# EAGLE design LoRaBB (EAGLE 9.6.2)
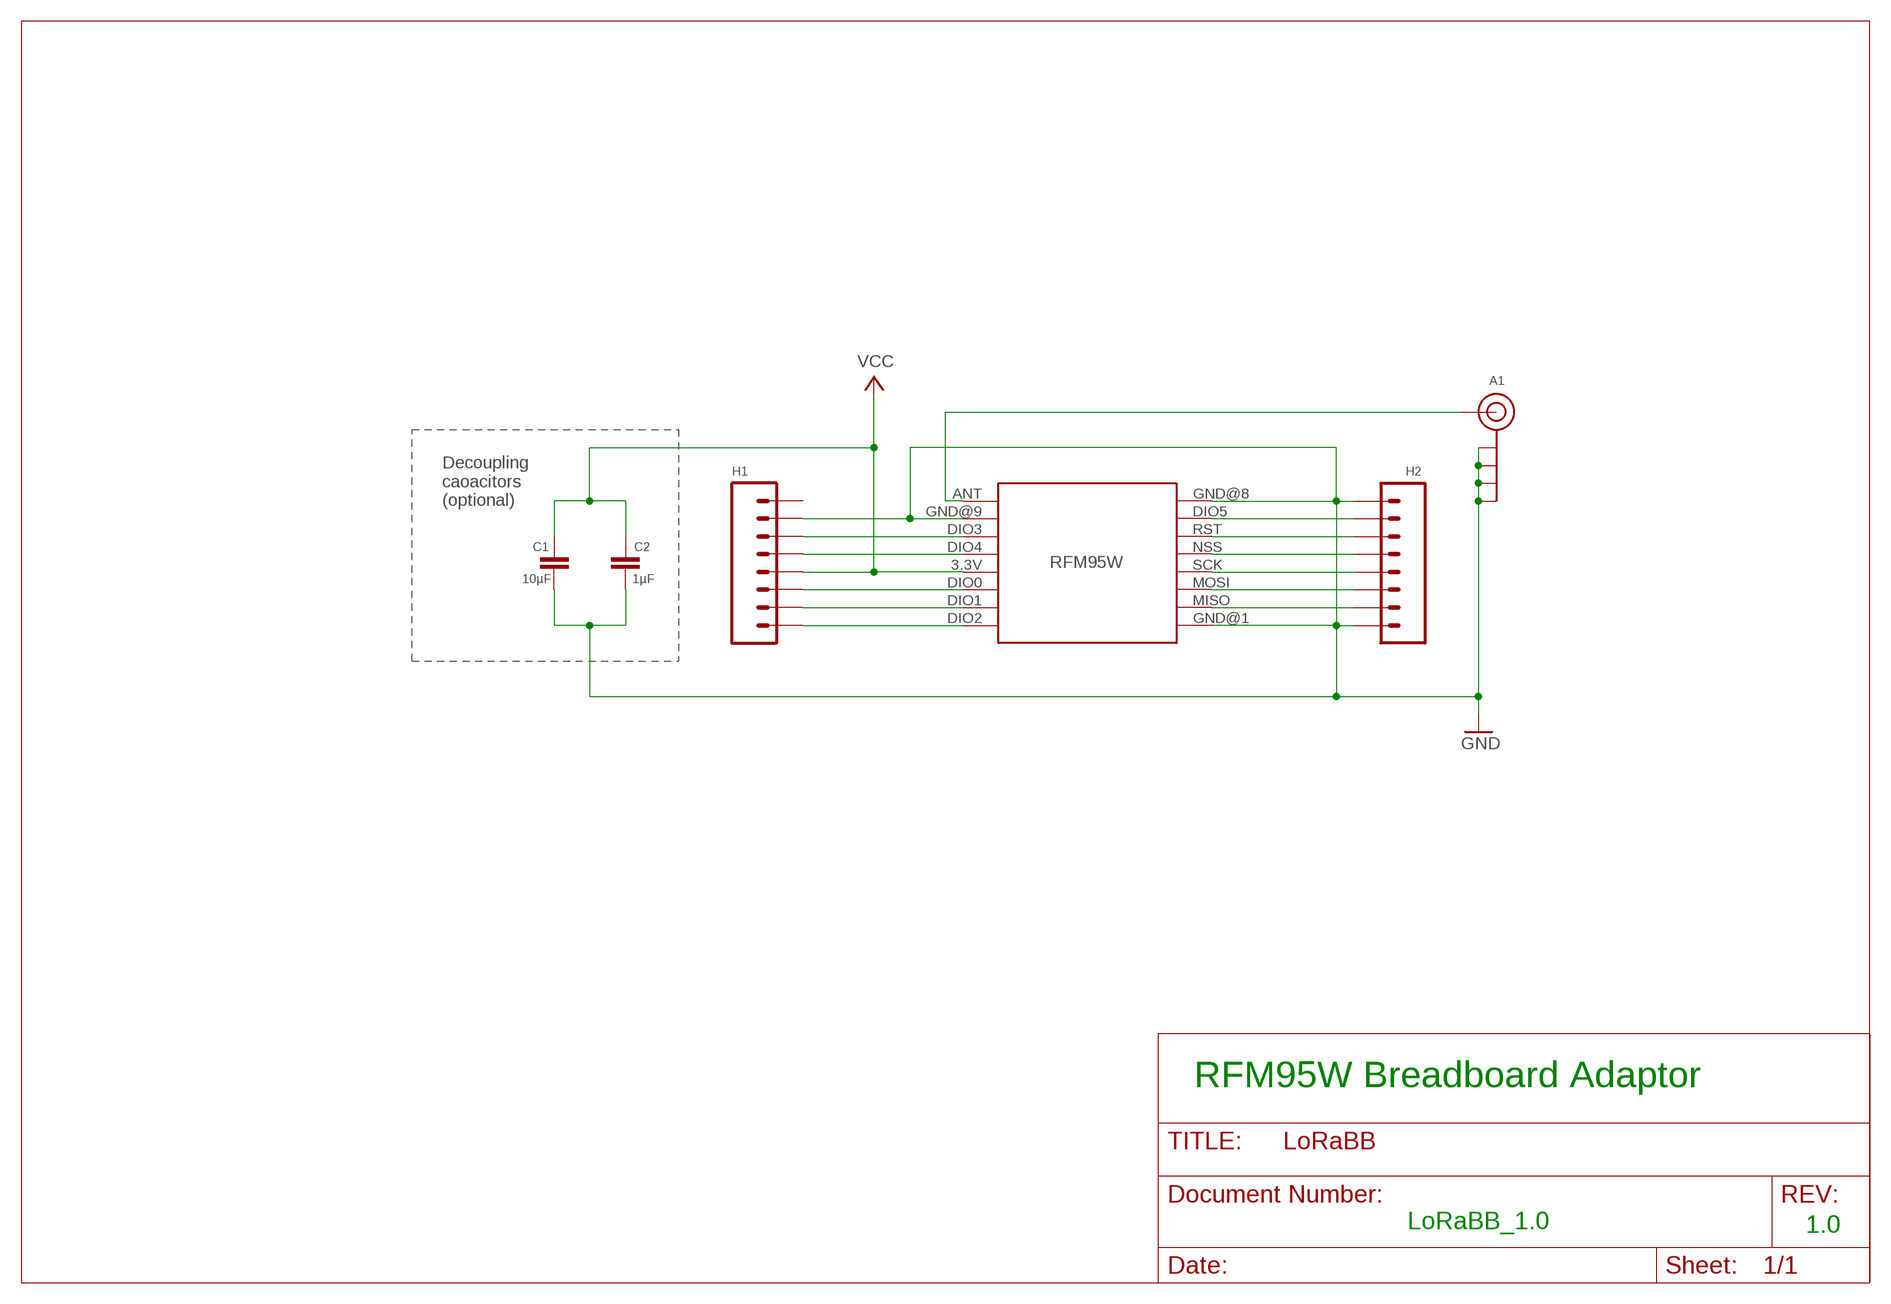
[diagram p0: schematic, sheet 1]

## Parts
A1  U.FL-SMA-EDGE-COMBO  [U.FL-SMA-EDGE-COMBO]
C1  10µF  CAPACITOR  [C0805]
C2  1µF  CAPACITOR  [C0805]
H1  1X8-PIN-HEADER  [1X8]
H2  1X8-PIN-HEADER  [1X8]
RFM95W  RFM95W-LORA  [RFM95W-LORA]

## Nets
GND: A1.GND@1A(GND) A1.GND@1B(GND) A1.GND@2A(GND) A1.GND@2B(GND) C1.2 C2.2 H1.2 H2.1 H2.8 RFM95W.GND@1(GND.1) RFM95W.GND@8(GND.2) RFM95W.GND@9(GND.3)
N$3: H2.2 RFM95W.DIO5
N$4: H2.4 RFM95W.NSS
N$8: H1.4 RFM95W.DIO4
N$9: H1.3 RFM95W.DIO3
N$11: A1.SIG RFM95W.ANT
N$12: H1.7 RFM95W.DIO1
N$13: H2.3 RFM95W.RST
N$15: H2.5 RFM95W.SCK
N$16: H2.6 RFM95W.MOSI
N$17: H2.7 RFM95W.MISO
N$27: H1.6 RFM95W.DIO0
N$32: H1.8 RFM95W.DIO2
VCC: C1.1 C2.1 H1.5 RFM95W.3.3V
Unconnected: H1.1

## Notes on the sheet
- Decoupling
  caoacitors
  (optional)
- RFM95W Breadboard Adaptor
- LoRaBB_1.0 | 1.0

## Library data of the parts
A1 = digitalconcepts:U.FL-SMA-EDGE-COMBO: Combination u.FL & SMA edge mount antenna
C1 C2 = digitalconcepts:CAPACITOR: 0805 Capacitor
H1 H2 = digitalconcepts:1X8-PIN-HEADER: Single Row 8-Pin Header
RFM95W = digitalconcepts:RFM95W-LORA: RFM95W LoRa Wireless Transceiver

## Board
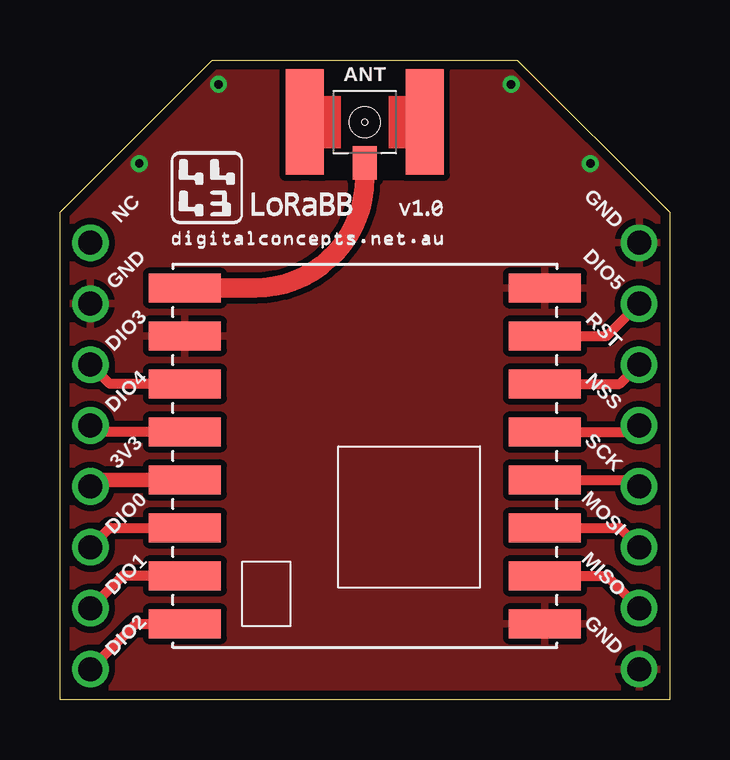
[diagram p1: board, top side]
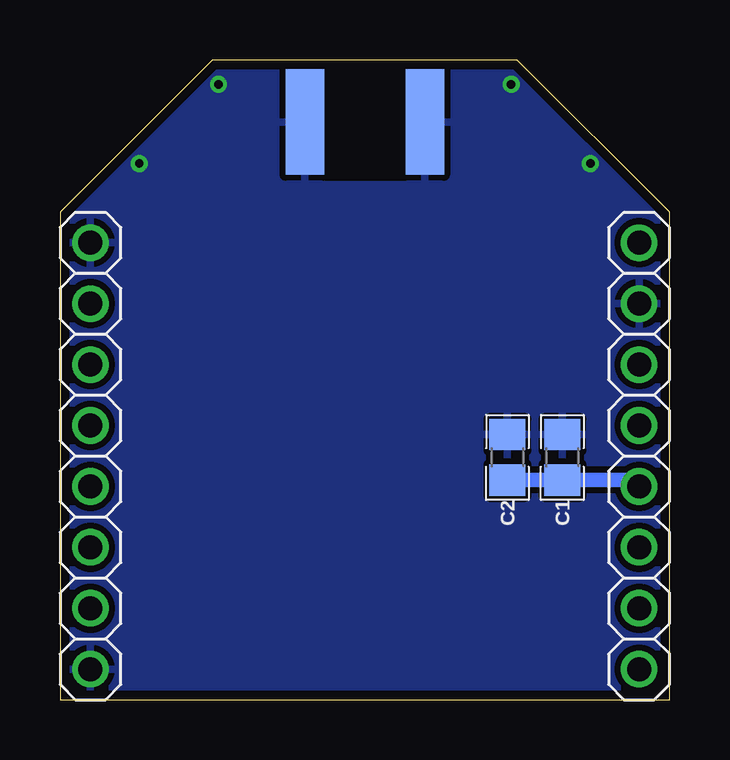
[diagram p2: board, bottom side, seen from below]

Size 25.4 x 26.67 mm. Coordinates in mm from the lower left corner, seen from the top.
Outline: 0,0 0,20.32 6.35,26.67 19.05,26.67 25.4,20.32 25.4,0 0,0
Copper layers (1*16): Top 0.0356mm / dielectric 1.5011mm / Bottom 0.0356mm
Design rules "PCBs_io": minimum track width 6mil, minimum drill 13mil, track to track 6mil, track to pad 6mil, pad to pad 6mil, via to via 6mil, smd to smd 6mil, copper to edge 15mil, drill to drill 6mil, minimum pad ring 7mil, minimum via ring 7mil, stop-mask expansion 3mil, vias tented up to drill 0mil, thermal gap 10mil

### Footprints (pad centres in the part's own frame; a part is rotated, then mirrored left to right if it is on the bottom)
U.FL-SMA-EDGE-COMBO = smd 1.6 x 4.4: GND@1A -2.5,0; GND@2A 2.5,0 | smd 1.6 x 4.4 bottom: GND@1B -2.5,0; GND@2B 2.5,0 | smd 1 x 1.4: SIG 0,-1.7
C0805 = smd 1.3 x 1.5: 1 -0.95,0; 2 0.95,0
1X8 = drill 1 pad 1.524: 1 0,0; 2 2.54,0; 3 5.08,0; 4 7.62,0; 5 10.16,0; 6 12.7,0; 7 15.24,0; 8 17.78,0
RFM95W-LORA = smd 3 x 1.2: 3.3V 7.5,1; ANT 7.5,-7; DIO0 7.5,3; DIO1 7.5,5; DIO2 7.5,7; DIO3 7.5,-3; DIO4 7.5,-1; DIO5 -7.5,-5; GND@1 -7.5,7; GND@8 -7.5,-7; GND@9 7.5,-5; MISO -7.5,5; MOSI -7.5,3; NSS -7.5,-1; RST -7.5,-3; SCK -7.5,1

### Placement (x,y rotation side)
A1  12.7,24.08 0 top
C1  4.47,10.1 90 bottom
C2  6.76,10.1 90 bottom
H1  1.27,19.05 270 top
H2  24.13,19.05 270 top
RFM95W  12.7,10.16 180 top

### Tracks (layer width: path | path; a pad name or v marks a point on that pad's centre or on a via)
GND  (via drill 0.35)
  other vias: 3.3,22.35 6.6,25.65 18.8,25.65 22.1,22.35
  pour Top (isolate 0.254): 6.35,26.67 19.05,26.67 25.4,20.32 25.4,0 21.59,0 3.81,0 0,0 0,20.32
  pour Bottom (isolate 0.254): 6.35,26.67 19.05,26.67 25.4,20.32 25.4,0 21.59,0 3.81,0 0,0 0,20.32
N$3
  Top 0.406: H2.2 22.79,15.16 RFM95W.DIO5
N$4
  Top 0.406: H2.4 23.86,11.16 RFM95W.NSS
N$8
  Top 0.406: H1.4 1.54,11.16 RFM95W.DIO4
N$9
  Top 0.406: H1.3 2.08,13.16 RFM95W.DIO3
N$11
  Top 0.813: A1.SIG 12.7,21.75 arc-90 8.11,17.16 RFM95W.ANT
N$12
  Top 0.305: RFM95W.DIO1 4.06,5.16
  Top 0.406: H1.7 2.62,5.16 4.06,5.16
N$13
  Top 0.406: H2.3 23.32,13.16 RFM95W.RST
N$15
  Top 0.406: H2.5 23.86,9.16 RFM95W.SCK
N$16
  Top 0.406: RFM95W.MOSI 23.32,7.16 H2.6
N$17
  Top 0.406: H2.7 22.78,5.16 RFM95W.MISO
N$27
  Top 0.406: H1.6 2.08,7.16 4.32,7.16 RFM95W.DIO0
N$32
  Top 0.406: H1.8 3.16,3.16 RFM95W.DIO2
VCC
  Top 0.61: H1.5 1.54,9.16 RFM95W.3.3V
  Bottom 0.61: H1.5 1.53,9.15 C1.1 C2.1

### Text on the board
tPlace: ANT | NC | GND | GND | DIO5 | DIO3 | RST | DIO4 | NSS | 3V3 | SCK | DIO0 | MOSI | DIO1 | MISO | DIO2 | GND